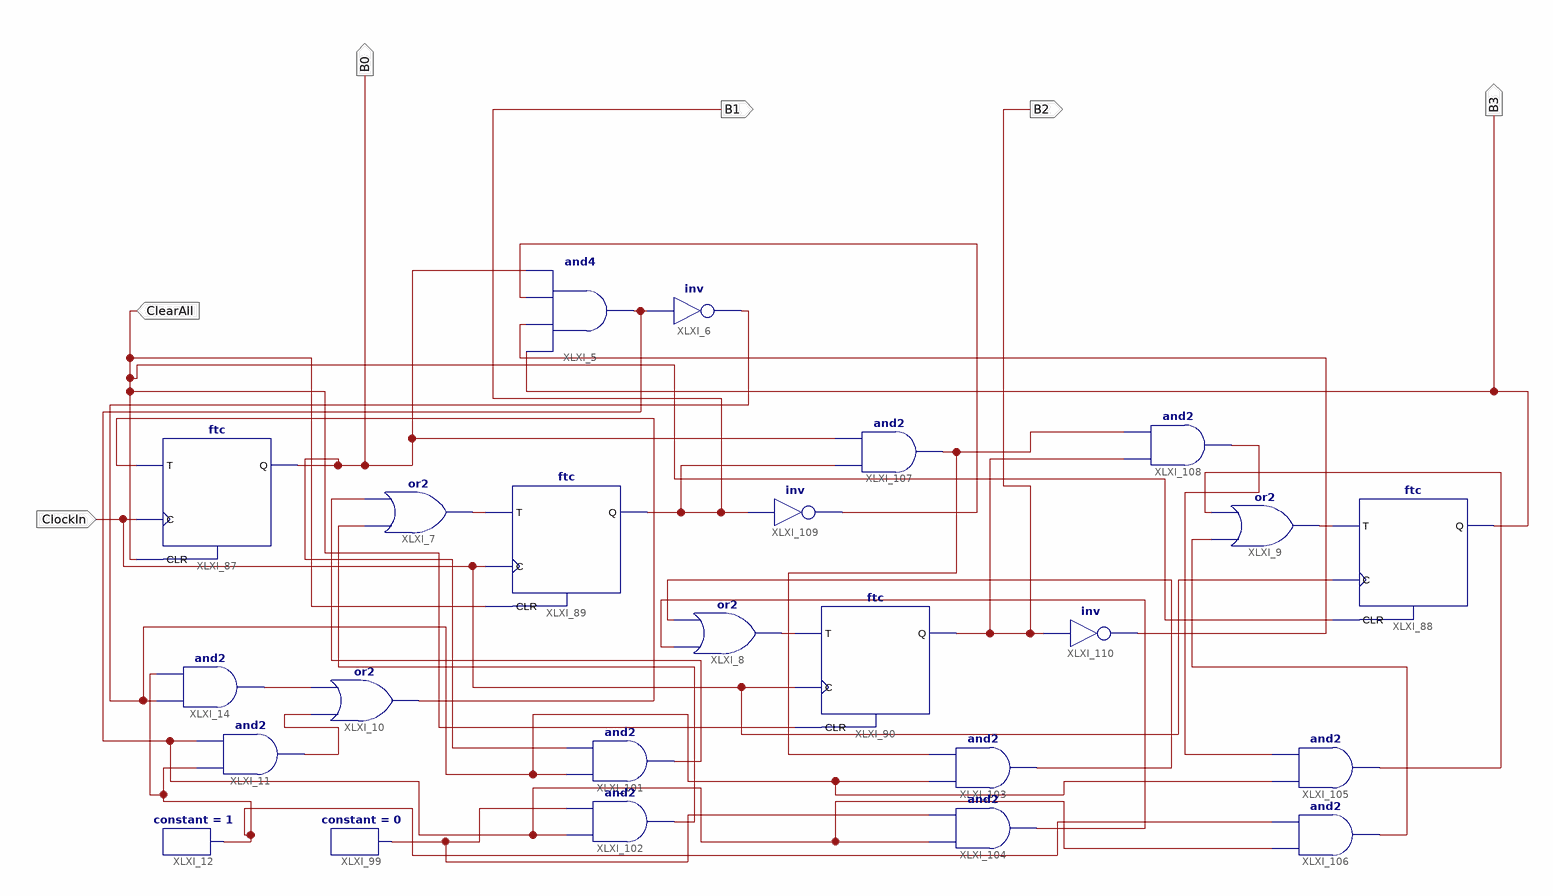
[diagram p0: schematic sheet 1]
// Xilinx ISE schematic ppppp.sch (spartan6) as structural Verilog: 24 symbols, 6 ports
module ppppp (
  input  ClockIn,
  input  ClearAll,
  output B0,
  output B1,
  output B2,
  output B3
);

  wire XLXN_4, XLXN_7, XLXN_16, XLXN_17, XLXN_18, XLXN_21, XLXN_22, XLXN_25, XLXN_40, XLXN_44, XLXN_45,
       XLXN_46, XLXN_219, XLXN_221, XLXN_223, XLXN_224, XLXN_226, XLXN_228, XLXN_229, XLXN_230;

  ftc XLXI_87 (.C(ClockIn), .CLR(ClearAll), .T(XLXN_230), .Q(B0));
  ftc XLXI_88 (.C(ClockIn), .CLR(ClearAll), .T(XLXN_223), .Q(B3));
  ftc XLXI_89 (.C(ClockIn), .CLR(ClearAll), .T(XLXN_221), .Q(B1));
  ftc XLXI_90 (.C(ClockIn), .CLR(ClearAll), .T(XLXN_7), .Q(B2));
  and XLXI_5 (XLXN_226, B3, XLXN_219, XLXN_4, B0);
  not XLXI_6 (XLXN_228, XLXN_226);
  or XLXI_7 (XLXN_221, XLXN_17, XLXN_16);
  or XLXI_8 (XLXN_7, XLXN_40, XLXN_22);
  or XLXI_9 (XLXN_223, XLXN_46, XLXN_45);
  or XLXI_10 (XLXN_230, XLXN_224, XLXN_229);
  and XLXI_11 (XLXN_224, XLXN_21, XLXN_226);
  constant #(.CValue("1")) XLXI_12 (.O(XLXN_21));
  constant #(.CValue("0")) XLXI_99 (.O(XLXN_18));
  and XLXI_14 (XLXN_229, XLXN_228, XLXN_21);
  and XLXI_101 (XLXN_16, XLXN_228, B0);
  and XLXI_102 (XLXN_17, XLXN_226, XLXN_18);
  and XLXI_103 (XLXN_22, XLXN_228, XLXN_25);
  and XLXI_104 (XLXN_40, XLXN_226, XLXN_18);
  and XLXI_105 (XLXN_45, XLXN_228, XLXN_44);
  and XLXI_106 (XLXN_46, XLXN_226, XLXN_21);
  and XLXI_107 (XLXN_25, B1, B0);
  and XLXI_108 (XLXN_44, B2, XLXN_25);
  not XLXI_109 (XLXN_4, B1);
  not XLXI_110 (XLXN_219, B2);
endmodule
